# EAGLE design 5vps (EAGLE 5.06)
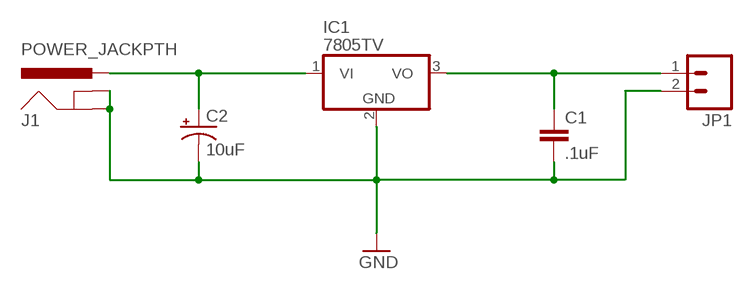
[diagram p0: schematic, sheet 1]

## Parts
C1  .1uF  CAPPTH2  [CAP-PTH-SMALL2]
C2  10uF  CAP_POLPTH2  [CPOL-RADIAL-10UF-25V]
IC1  7805TV  [TO220V]
J1  POWER_JACKPTH  [POWER_JACK_PTH]
JP1  M02LOCK  [1X02_LOCK]

## Nets
GND: C1.2 C2.2(-) IC1.2(GND) J1.GND J1.GNDBREAK JP1.2
N$1: C2.1(+) IC1.1(VI) J1.PWR
N$3: C1.1 IC1.3(VO) JP1.1

## Library data of the parts
C1 = SparkFun:CAP: Capacitor Standard 0603 ceramic capacitor, and 0.1" leaded capacitor.
C2 = SparkFun:CAP_POL: Capacitor Polarized These are standard SMD and PTH capacitors. Normally 10uF, 47uF, and 100uF in electrolytic and tantalum varieties. Always verify the external diameter of the through hole cap, it varies with capacity, voltage, and manufacturer. The EIA devices should be standard.
IC1 = linear:78*: Positive VOLTAGE REGULATOR Source: http://cache.national.com/ds/LM/LM78L05.pdf http://www.fairchildsemi.com/ds/LM/LM7805.pdf
J1 = SparkFun:POWER_JACK: Power Jack This is the standard 5.5mm barrel jack for power. The PTH is the most common, proven, reliable, footprint. All others are experimental. The Slot footprint only works if the mill layer is transmitted to the PCB fab house so be warned. Spark Fun Electronics SKU : PRT-00119. Mating wall wart : TOL-00298 (and others)
JP1 = SparkFun:M02: Header 2 Standard 2-pin 0.1" header. Use with straight break away headers (SKU : PRT-00116), right angle break away headers (PRT-00553), swiss pins (PRT-00743), machine pins (PRT-00117), and female headers (PRT-00115). Molex polarized connector foot print use with SKU : PRT-08233 with associated crimp pins and housings.

## Net classes
1 ground: width 0.013 mm
2 positive: width 0.013 mm

## Board
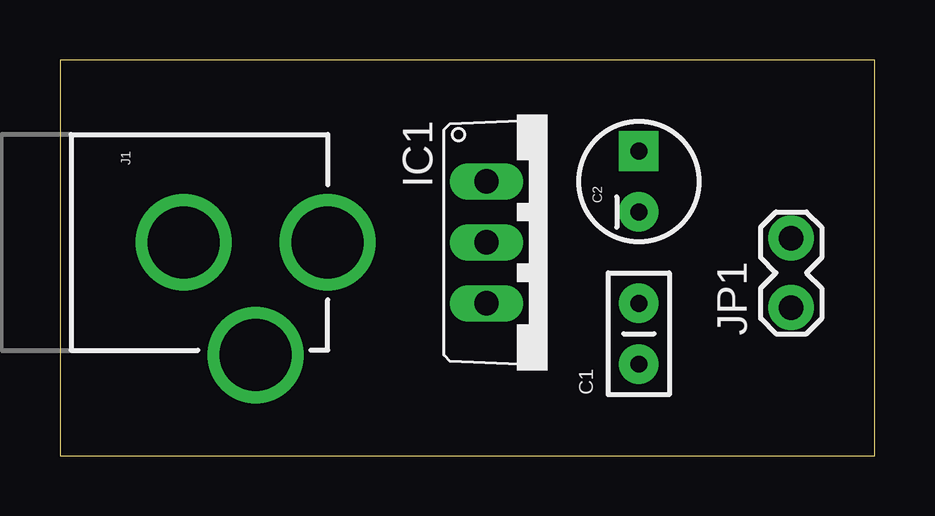
[diagram p1: board, top side]
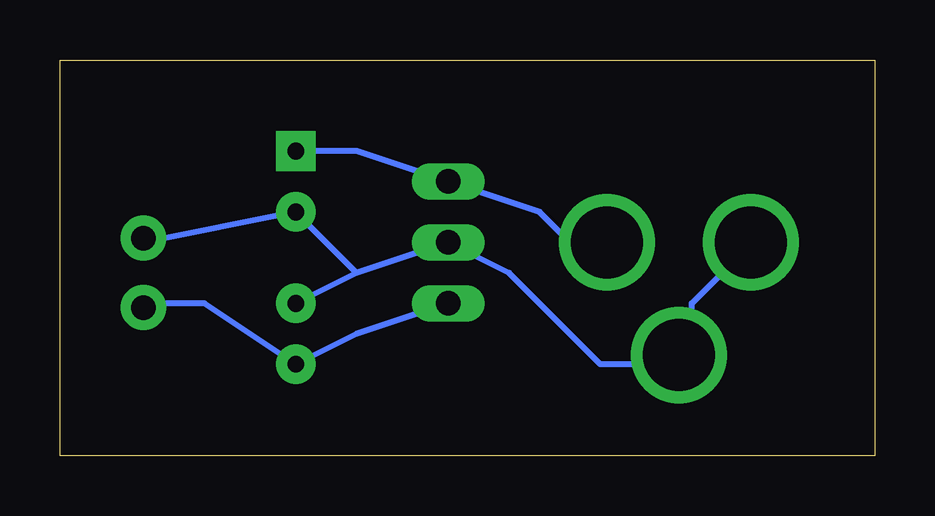
[diagram p2: board, bottom side, seen from below]

Size 33.96 x 16.5 mm. Coordinates in mm from the lower left corner, seen from the top.
Outline: 0,0 33.96,0 33.96,16.5 0,16.5 0,0
Copper layers (1*16): Top 0.035mm / dielectric 1.5mm / Bottom 0.035mm
Design rules "default": minimum track width 10mil, minimum drill 24mil, track to track 8mil, track to pad 8mil, pad to pad 8mil, via to via 8mil, smd to smd 8mil, copper to edge 40mil, drill to drill 8mil, minimum pad ring 10mil, minimum via ring 8mil, stop-mask expansion 4mil, vias tented up to drill 0mil, thermal gap 10mil

### Footprints (pad centres in the part's own frame; a part is rotated, then mirrored left to right if it is on the bottom)
CAP-PTH-SMALL2 = drill 0.7 pad 1.651 round: 1 0,0; 2 2.54,0
CPOL-RADIAL-10UF-25V = drill 0.7 pad 1.651 square: 1 1.27,0 | drill 0.7 pad 1.651 round: 2 -1.27,0
TO220V = drill 1.016 long: 1 -2.54,-2.54; 2 0,-2.54; 3 2.54,-2.54
POWER_JACK_PTH = drill 2.997 round: GND 0,7.7; GNDBREAK 4.7,10.7; PWR 0,13.7
1X02_LOCK = drill 1.016 pad 1.88 round: 1 -0.178,0; 2 2.718,0

### Placement (x,y rotation side)
C1  24.13,3.81 90 top
C2  24.13,11.43 90 top
IC1  20.32,8.89 270 top
J1  -2.54,8.89 270 top
JP1  30.48,6.35 90 top

### Tracks (layer width: path | path; a pad name or v marks a point on that pad's centre or on a via)
GND
  Bottom 0.254: 21.59,7.62 IC1.2 15.24,7.62 11.43,3.81 8.89,3.81 J1.GNDBREAK 7.62,3.81 7.62,6.35 6.35,7.62 J1.GND | 21.59,7.62 C2.2 30.48,8.89 JP1.2 | 21.59,7.62 C1.2
N$1
  Bottom 0.254: C2.1 21.59,12.7 IC1.1 13.97,10.16 11.43,7.62 J1.PWR
N$3
  Bottom 0.254: IC1.3 21.59,5.08 C1.1 27.94,6.35 30.48,6.35 JP1.1